# EAGLE design ToastSchematic (EAGLE 8.4.1)

## Sheet 1 of 2
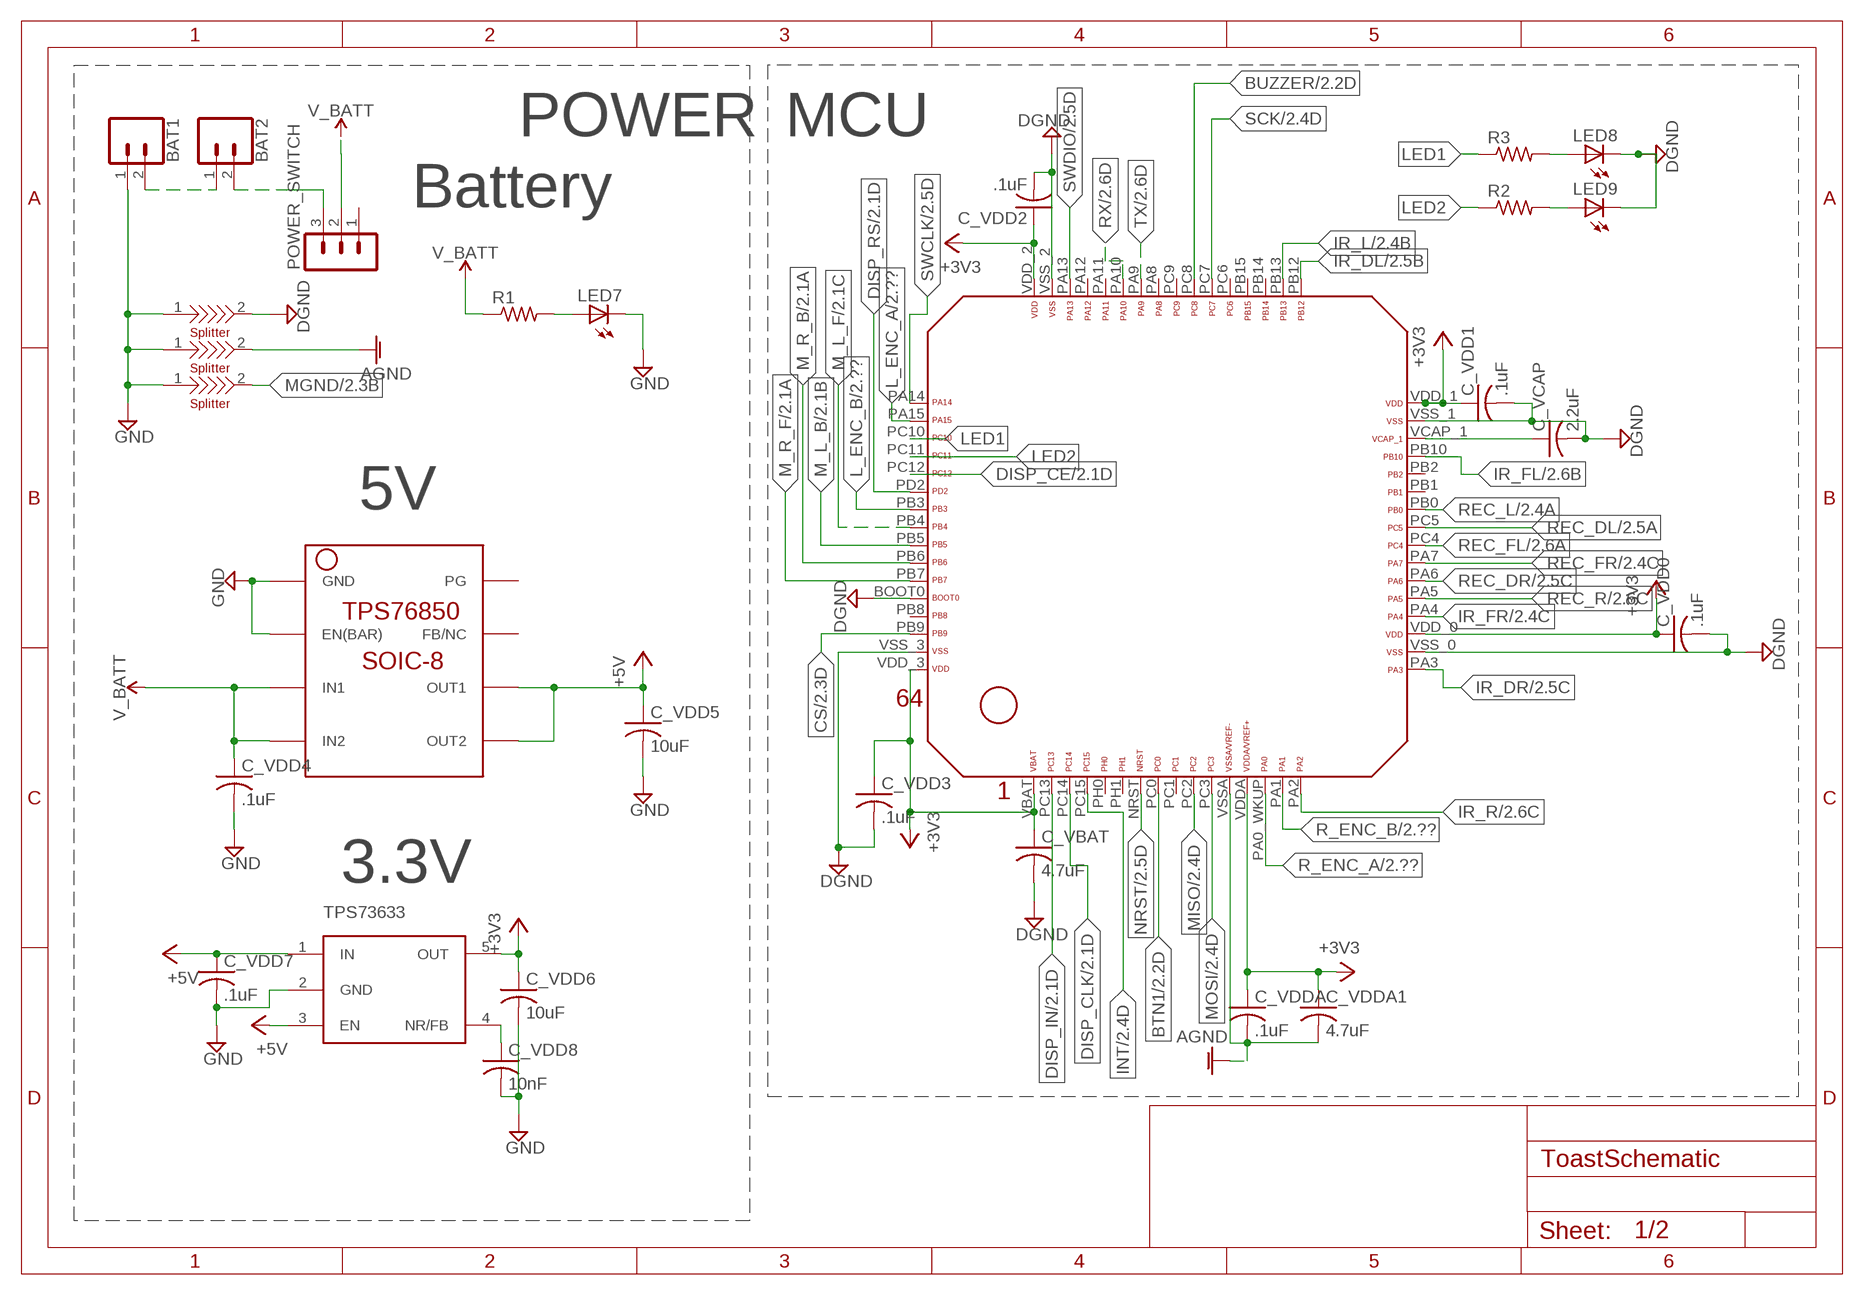
[diagram p0: schematic, sheet 1]

### Parts
BAT1  CONN_02JST-PTH-2  [JST-2-PTH]
BAT2  CONN_02JST-PTH-2  [JST-2-PTH]
C_VBAT  4.7uF  C-USC0603  [C0603]
C_VCAP  2.2uF  C-USC0603  [C0603]
C_VDD0  .1uF  C-USC0603  [C0603]
C_VDD1  .1uF  C-USC0603  [C0603]
C_VDD2  .1uF  C-USC0603  [C0603]
C_VDD3  .1uF  C-USC0603  [C0603]
C_VDD4  .1uF  C-USC0603  [C0603]
C_VDD5  10uF  C-USC0603  [C0603]
C_VDD6  10uF  C-USC0603  [C0603]
C_VDD7  .1uF  C-USC0603  [C0603]
C_VDD8  10nF  C-USC0603  [C0603]
C_VDDA  .1uF  C-USC0603  [C0603]
C_VDDA1  4.7uF  C-USC0603  [C0603]
LED7  LED5MM  [LED5MM]
LED8  LEDCHIPLED_0603  [CHIPLED_0603]
LED9  LEDCHIPLED_0603  [CHIPLED_0603]
POWER_SWITCH  MA03-1  [MA03-1]
R1  R-US_R0603  [R0603]
R2  R-US_R0603  [R0603]
R3  R-US_R0603  [R0603]
U$1  STM32F411/446_LQFP64  [STM32F411/446_LQFP64]
U$2  TPS73633  [SOT23-5L]
U$3  TPS76850(SOIC-8)  [TPS76850(SOIC-8)]
U$5  SPLITTER  [SPLITTER]
U$8  SPLITTER  [SPLITTER]
U$9  SPLITTER  [SPLITTER]

### Nets
+3V3: C_VBAT.1 C_VDD0.1 C_VDD1.1 C_VDD2.1 C_VDD3.1 C_VDD6.1 C_VDDA1.1 C_VDDA.1 U$1.VBAT U$1.VDD_0 U$1.VDD_1 U$1.VDD_2 U$1.VDD_3 U$1.VDDA U$2.5(OUT) ; also sheet 2
+5V: C_VDD5.1 C_VDD7.1 U$2.1(IN) U$2.3(EN) U$3.OUT1 U$3.OUT2 ; also sheet 2
AGND: C_VDDA1.2 C_VDDA.2 U$1.VSSA U$8.2 ; also sheet 2
BTN1: U$1.PC0 ; also sheet 2
BUZZER: U$1.PC8 ; also sheet 2
CS: U$1.PB9 ; also sheet 2
DGND: C_VBAT.2 C_VCAP.2 C_VDD0.2 C_VDD1.2 C_VDD2.2 C_VDD3.2 LED8.C LED9.C U$1.BOOT0 U$1.VSS_0 U$1.VSS_1 U$1.VSS_2 U$1.VSS_3 U$5.2 ; also sheet 2
DISP_CE: U$1.PC12 ; also sheet 2
DISP_CLK: U$1.PC14 ; also sheet 2
DISP_IN: U$1.PC13 ; also sheet 2
DISP_RS: U$1.PD2 ; also sheet 2
GND: BAT1.1 C_VDD4.2 C_VDD5.2 C_VDD6.2 C_VDD7.2 C_VDD8.2 LED7.K(C) U$2.2(GND) U$3.EN(BAR) U$3.GND U$5.1 U$8.1 U$9.1
INT: U$1.PC15 ; also sheet 2
IR_DL: U$1.PB12 ; also sheet 2
IR_DR: U$1.PA3 ; also sheet 2
IR_FL: U$1.PB10 ; also sheet 2
IR_FR: U$1.PA4 ; also sheet 2
IR_L: U$1.PB13 ; also sheet 2
IR_R: U$1.PA2 ; also sheet 2
L_ENC_A: U$1.PA15 ; also sheet 2
L_ENC_B: U$1.PB3 ; also sheet 2
LED1: R3.1 U$1.PC10
LED2: R2.1 U$1.PC11
M_L_B: U$1.PB5 ; also sheet 2
M_L_F: U$1.PB4 ; also sheet 2
M_R_B: U$1.PB6 ; also sheet 2
M_R_F: U$1.PB7 ; also sheet 2
MGND: U$9.2 ; also sheet 2
MISO: U$1.PC2 ; also sheet 2
MOSI: U$1.PC3 ; also sheet 2
N$1: BAT1.2 BAT2.1
N$2: BAT2.2 POWER_SWITCH.3
N$5: C_VCAP.1 U$1.VCAP_1
N$6: C_VDD8.1 U$2.4(NR/FB)
N$21: LED7.A R1.2
N$22: LED8.A R3.2
N$25: LED9.A R2.2
NRST: U$1.NRST ; also sheet 2
R_ENC_A: U$1.PA0_WKUP(PA0_AKUP) ; also sheet 2
R_ENC_B: U$1.PA1 ; also sheet 2
REC_DL: U$1.PC5 ; also sheet 2
REC_DR: U$1.PA6 ; also sheet 2
REC_FL: U$1.PC4 ; also sheet 2
REC_FR: U$1.PA7 ; also sheet 2
REC_L: U$1.PB0 ; also sheet 2
REC_R: U$1.PA5 ; also sheet 2
RX: U$1.PA10 ; also sheet 2
SCK: U$1.PC7 ; also sheet 2
SWCLK: U$1.PA14 ; also sheet 2
SWDIO: U$1.PA13 ; also sheet 2
TX: U$1.PA9 ; also sheet 2
V_BATT: C_VDD4.1 POWER_SWITCH.2 R1.1 U$3.IN1 U$3.IN2 ; also sheet 2
Unconnected: POWER_SWITCH.1 U$1.PA8 U$1.PA11 U$1.PA12 U$1.PB1 U$1.PB2 U$1.PB8 U$1.PB14 U$1.PB15 U$1.PC1 U$1.PC6 U$1.PC9 U$1.PH0 U$1.PH1 U$3.FB/NC U$3.PG

### Notes on the sheet
- POWER | MCU
- Battery
- 5V
- 3.3V

## Sheet 2 of 2
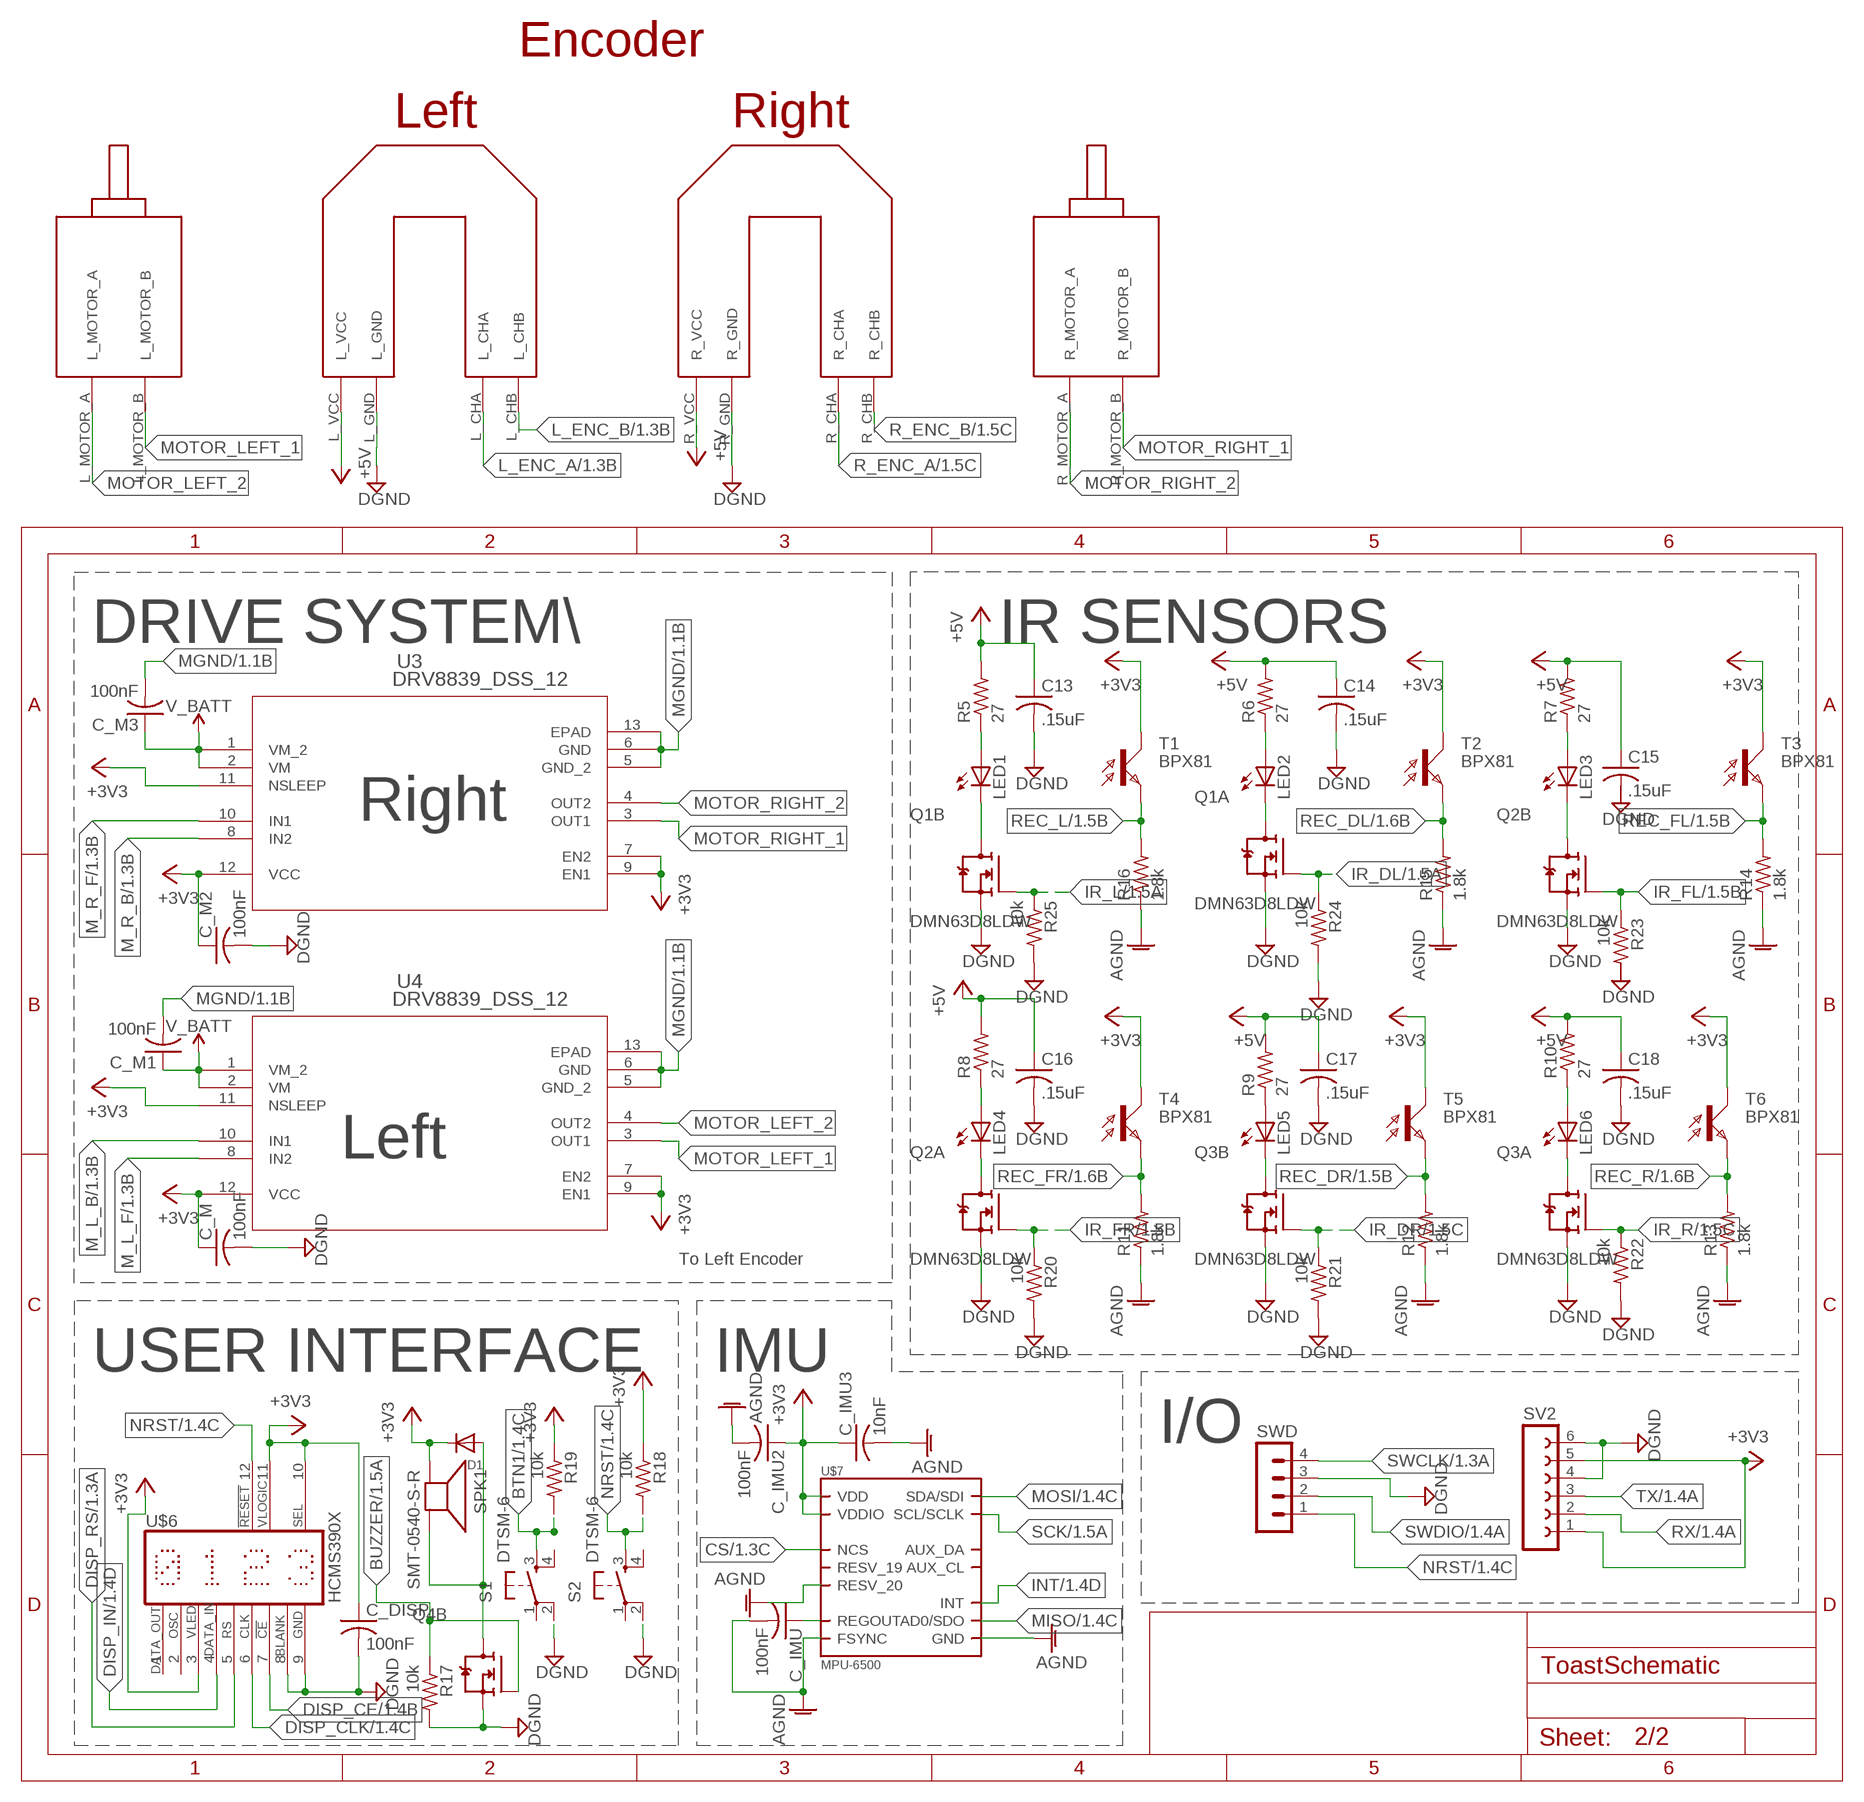
[diagram p1: schematic, sheet 2]

### Parts
C13  .15uF  C-USC0603K  [C0603K]
C14  .15uF  C-USC0603K  [C0603K]
C15  .15uF  C-USC0603K  [C0603K]
C16  .15uF  C-USC0603K  [C0603K]
C17  .15uF  C-USC0603K  [C0603K]
C18  .15uF  C-USC0603K  [C0603K]
C_DISP  100nF  C-USC0603K  [C0603K]
C_IMU  100nF  C-USC0603K  [C0603K]
C_IMU2  100nF  C-USC0603K  [C0603K]
C_IMU3  10nF  C-USC0603K  [C0603K]
C_M  100nF  C-USC0603K  [C0603K]
C_M1  100nF  C-USC0603K  [C0603K]
C_M2  100nF  C-USC0603K  [C0603K]
C_M3  100nF  C-USC0603K  [C0603K]
D1  DIODESOD-323F  [SOD-323F]
LED1  LED5MM  [LED5MM]
LED2  LED5MM  [LED5MM]
LED3  LED5MM  [LED5MM]
LED4  LED5MM  [LED5MM]
LED5  LED5MM  [LED5MM]
LED6  LED5MM  [LED5MM]
Q1  DMN63D8LDW  [SOT363]
Q2  DMN63D8LDW  [SOT363]
Q3  DMN63D8LDW  [SOT363]
Q4  DMN63D8LDW  [SOT363]
R5  27  R-US_R0603  [R0603]
R6  27  R-US_R0603  [R0603]
R7  27  R-US_R0603  [R0603]
R8  27  R-US_R0603  [R0603]
R9  27  R-US_R0603  [R0603]
R10  27  R-US_R0603  [R0603]
R11  1.8k  R-US_R0603  [R0603]
R12  1.8k  R-US_R0603  [R0603]
R13  1.8k  R-US_R0603  [R0603]
R14  1.8k  R-US_R0603  [R0603]
R15  1.8k  R-US_R0603  [R0603]
R16  1.8k  R-US_R0603  [R0603]
R17  10k  R-US_R0603  [R0603]
R18  10k  R-US_R0603  [R0603]
R19  10k  R-US_R0603  [R0603]
R20  10k  R-US_R0603  [R0603]
R21  10k  R-US_R0603  [R0603]
R22  10k  R-US_R0603  [R0603]
R23  10k  R-US_R0603  [R0603]
R24  10k  R-US_R0603  [R0603]
R25  10k  R-US_R0603  [R0603]
S1  DTSM-6  [DTSM-6]
S2  DTSM-6  [DTSM-6]
SPK1  SMT-0540-S-R  [SMT-0540-S-R]
SV2  FE06-1  [FE06]
SWD  MA04-1  [MA04-1]
T1  BPX81  [BPX81]
T2  BPX81  [BPX81]
T3  BPX81  [BPX81]
T4  BPX81  [BPX81]
T5  BPX81  [BPX81]
T6  BPX81  [BPX81]
U3  DRV8839_DSS_12  [DSS12_P9X2]
U4  DRV8839_DSS_12  [DSS12_P9X2]
U$4  FUTURA_V1.0_MOTOR_MOUNT  [FUTURA_V1.0_MOTOT_MOUNT]
U$6  HCMS390X  [HCMS390X]
U$7  MPU-6500  [QFN.24.4X4]

### Nets
+3V3: C_DISP.1 C_IMU2.1 C_IMU3.1 C_M2.1 C_M.1 D1.C R18.1 R19.1 SPK1.-(+) SV2.1 SV2.5 T1.C T2.C T3.C T4.C T5.C T6.C U3.7(EN2) U3.9(EN1) U3.11(NSLEEP) U3.12(VCC) U4.7(EN2) U4.9(EN1) U4.11(NSLEEP) U4.12(VCC) U$6.3(VLED) U$6.10(SEL) U$6.11(VLOGIC) U$7.8(VDDIO) U$7.13(VDD) ; also sheet 1
+5V: C13.1 C14.1 C15.1 C16.1 C17.1 C18.1 R5.2 R6.2 R7.2 R8.2 R9.2 R10.2 U$4.L_VCC U$4.R_VCC ; also sheet 1
AGND: C_IMU2.2 C_IMU3.2 C_IMU.2 R11.1 R12.1 R13.1 R14.1 R15.1 R16.1 U$7.11(FSYNC) U$7.18(GND) U$7.20(RESV_20) ; also sheet 1
BTN1: R19.2 S1.3 ; also sheet 1
BUZZER: Q4.5(B:G) R17.1 ; also sheet 1
CS: U$7.22(NCS) ; also sheet 1
DGND: C13.2 C14.2 C16.2 C17.2 C18.2 C_DISP.2 C_M2.2 C_M.2 Q1.1(A:S) Q1.4(B:S) Q2.1(A:S) Q2.4(B:S) Q3.1(A:S) Q3.4(B:S) Q4.4(B:S) R17.2 R20.2 R21.2 R22.2 R24.2 R25.2 S1.2 S2.2 SV2.4 SV2.6 SWD.3 U$4.L_GND U$4.R_GND U$6.8(BLANK) U$6.9(GND) ; also sheet 1
DISP_CE: U$6.7(!CE) ; also sheet 1
DISP_CLK: U$6.6(CLK) ; also sheet 1
DISP_IN: U$6.4(IN) ; also sheet 1
DISP_RS: U$6.5(RS) ; also sheet 1
INT: U$7.12(INT) ; also sheet 1
IR_DL: Q1.2(A:G) R24.1 ; also sheet 1
IR_DR: Q3.5(B:G) R21.1 ; also sheet 1
IR_FL: Q2.5(B:G) R23.1 ; also sheet 1
IR_FR: Q2.2(A:G) R20.1 ; also sheet 1
IR_L: Q1.5(B:G) R25.1 ; also sheet 1
IR_R: Q3.2(A:G) R22.1 ; also sheet 1
L_ENC_A: U$4.L_CHA ; also sheet 1
L_ENC_B: U$4.L_CHB ; also sheet 1
M_L_B: U4.10(IN1) ; also sheet 1
M_L_F: U4.8(IN2) ; also sheet 1
M_R_B: U3.8(IN2) ; also sheet 1
M_R_F: U3.10(IN1) ; also sheet 1
MGND: C_M1.2 C_M3.2 U3.5(GND_2) U3.6(GND) U3.13(EPAD) U4.5(GND_2) U4.6(GND) U4.13(EPAD) ; also sheet 1
MISO: U$7.9(AD0/SDO) ; also sheet 1
MOSI: U$7.24(SDA/SDI) ; also sheet 1
MOTOR_LEFT_1: U4.3(OUT1) U$4.L_MOTOR_B
MOTOR_LEFT_2: U4.4(OUT2) U$4.L_MOTOR_A
MOTOR_RIGHT_1: U3.3(OUT1) U$4.R_MOTOR_B
MOTOR_RIGHT_2: U3.4(OUT2) U$4.R_MOTOR_A
N$8: LED1.A R5.1
N$9: LED1.K(C) Q1.3(B:D)
N$10: LED2.A R6.1
N$11: LED2.K(C) Q1.6(A:D)
N$12: LED3.K(C) Q2.3(B:D)
N$13: LED3.A R7.1
N$14: LED6.A R10.1
N$15: LED6.K(C) Q3.6(A:D)
N$16: LED4.A R8.1
N$17: C_IMU.1 U$7.10(REGOUT)
N$18: LED4.K(C) Q2.6(A:D)
N$19: LED5.A R9.1
N$20: LED5.K(C) Q3.3(B:D)
N$23: D1.A Q4.3(B:D) SPK1.+(-)
NRST: R18.2 S2.3 SWD.1 U$6.12(NOT_RESET) ; also sheet 1
R_ENC_A: U$4.R_CHA ; also sheet 1
R_ENC_B: U$4.R_CHB ; also sheet 1
REC_DL: R15.2 T2.E ; also sheet 1
REC_DR: R12.2 T5.E ; also sheet 1
REC_FL: R14.2 T3.E ; also sheet 1
REC_FR: R11.2 T4.E ; also sheet 1
REC_L: R16.2 T1.E ; also sheet 1
REC_R: R13.2 T6.E ; also sheet 1
RX: SV2.2 ; also sheet 1
SCK: U$7.23(SCL/SCLK) ; also sheet 1
SWCLK: SWD.4 ; also sheet 1
SWDIO: SWD.2 ; also sheet 1
TX: SV2.3 ; also sheet 1
V_BATT: C_M1.1 C_M3.1 U3.1(VM_2) U3.2(VM) U4.1(VM_2) U4.2(VM) ; also sheet 1
Unconnected: C15.2 Q4.1(A:S) Q4.2(A:G) Q4.6(A:D) R23.2 S1.1 S1.4 S2.1 S2.4 U$6.1(OUT) U$6.2(OSC) U$7.7(AUX_CL) U$7.19(RESV_19) U$7.21(AUX_DA)

### Notes on the sheet
- DRIVE SYSTEM\ | IR SENSORS
- Right
- Left
- To Left Encoder
- USER INTERFACE | IMU
- I/O

## Library data of the parts
BAT1 BAT2 = SparkFun-Connectors:CONN_02: Multi connection point. Often used as Generic Header-pin footprint for 0.1 inch spaced/style header connections On any of the 0.1 inch spaced packages, you can populate with these: Break Away Headers - Straight <https://www.sparkfun.com/products/116> (PRT-00116) Break Away Male Headers - Right Angle <https://www.sparkfun.com/products/553> (PRT-00553) Female Headers <https://www.sparkfun.com/products/115> (PRT-00115) Break Away Headers - Machine Pin <https://www.sparkfun.com/products/117> (PRT-00117) Break Away Female Headers - Swiss Machine Pin <https://www.sparkfun.com/products/743> (PRT-00743) For SCREWTERMINALS and SPRING TERMINALS visit here: Screw Terimnals on SparkFun.com <https://www.sparkfun.com/search/results?term=Screw+Terminals> (5mm/3.5mm/2.54mm spacing) This device is also useful as a general connection point to wire up your design to another part of your project. Our various solder wires solder well into these plated through hole pads. Hook-Up Wire - Assortment (Stranded, 22 AWG) <https://www.sparkfun.com/products/11375> (PRT-11375) Hook-Up Wire - Assortment (Solid Core, 22 AWG) <https://www.sparkfun.com/products/11367> (PRT-11367) View the entire wire category on our website here <https://www.sparkfun.com/categories/141> Special notes: Molex polarized connector foot print use with: PRT-08233 with associated crimp pins and housings. 2.54_SCREWTERM for use with PRT-10571. 3.5mm Screw Terminal footprints for PRT-08084 5mm Screw Terminal footprints for use with PRT-08432; PROD_ID: CONN-09863; SKU: PRT-09914
C13-C18 C_DISP C_IMU C_IMU2 C_IMU3 C_M C_M1-C_M3 C_VBAT C_VCAP C_VDD0 C_VDD1-C_VDD8 C_VDDA C_VDDA1 = rcl:C-US: CAPACITOR, American symbol
D1 = adafruit:DIODE: Diode SMADIODE - SMA Surface Mount Package 20V 1A Schottky Diode Digikey: 641-1014-6-ND DO-1N4148 - Through Hole Small Current Diode SOD-123 20V 1 A (.5mV Vf) Schottky Diode - Digikey: MBRX120TPMSCT-ND SOD-323 10V 570mA (.38mV Vf, 3ns) Schottky Diode - Digikey: ZLLS410CT-ND SOD-523 30V 30mA Schottky Diode (RB751S-40TE61) - Digikey: RB751S-40TE61CT-ND SOT23-R/W - SOT23 Package (R = Solder Paste/Reflow Ovens, W = Hand-Soldering) BAT54Film 40V 300mA - Digikey: 497-7162-1-ND
LED1-LED9 = led:LED: LED OSRAM: - CHIPLED LG R971, LG N971, LY N971, LG Q971, LY Q971, LO R971, LY R971 LH N974, LH R974 LS Q976, LO Q976, LY Q976 LO Q996 - Hyper CHIPLED LW Q18S LB Q993, LB Q99A, LB R99A - SideLED LS A670, LO A670, LY A670, LG A670, LP A670 LB A673, LV A673, LT A673, LW A673 LH A674 LY A675 LS A676, LA A676, LO A676, LY A676, LW A676 LS A679, LY A679, LG A679 - Hyper Micro SIDELED® LS Y876, LA Y876, LO Y876, LY Y876 LT Y87S - SmartLED LW L88C, LW L88S LB L89C, LB L89S, LG L890 LS L89K, LO L89K, LY L89K LS L896, LA L896, LO L896, LY L896 - TOPLED LS T670, LO T670, LY T670, LG T670, LP T670 LSG T670, LSP T670, LSY T670, LOP T670, LYG T670 LG T671, LOG T671, LSG T671 LB T673, LV T673, LT T673, LW T673 LH T674 LS T676, LA T676, LO T676, LY T676, LB T676, LH T676, LSB T676, LW T676 LB T67C, LV T67C, LT T67C, LS T67K, LO T67K, LY T67K, LW E67C LS E67B, LA E67B, LO E67B, LY E67B, LB E67C, LV E67C, LT E67C LW T67C LS T679, LY T679, LG T679 LS T770, LO T770, LY T770, LG T770, LP T770 LB T773, LV T773, LT T773, LW T773 LH T774 LS E675, LA E675, LY E675, LS T675 LS T776, LA T776, LO T776, LY T776, LB T776 LHGB T686 LT T68C, LB T68C - Hyper Mini TOPLED® LB M676 - Mini TOPLED Santana® LG M470 LS M47K, LO M47K, LY M47K Source: http://www.osram.convergy.de LUXEON: - LUMILED® LXK2-PW12-R00, LXK2-PW12-S00, LXK2-PW14-U00, LXK2-PW14-V00 LXK2-PM12-R00, LXK2-PM12-S00, LXK2-PM14-U00 LXK2-PE12-Q00, LXK2-PE12-R00, LXK2-PE12-S00, LXK2-PE14-T00, LXK2-PE14-U00 LXK2-PB12-K00, LXK2-PB12-L00, LXK2-PB12-M00, LXK2-PB14-N00, LXK2-PB14-P00, LXK2-PB14-Q00 LXK2-PR12-L00, LXK2-PR12-M00, LXK2-PR14-Q00, LXK2-PR14-R00 LXK2-PD12-Q00, LXK2-PD12-R00, LXK2-PD12-S00 LXK2-PH12-R00, LXK2-PH12-S00 LXK2-PL12-P00, LXK2-PL12-Q00, LXK2-PL12-R00 Source: www.luxeon.com KINGBRIGHT: KA-3528ASYC Source: www.kingbright.com
POWER_SWITCH = con-lstb:MA03-1: PIN HEADER; OC_FARNELL: unknown; OC_NEWARK: unknown
Q1-Q4 = DMN63D8LDW:DMN63D8LDW: Dual N-channel enhancement mode MOSFET
R1 R5-R25 = rcl:R-US_: RESISTOR, American symbol
R2 R3 = resistor:R-US_: RESISTOR, American symbol
S1 S2 = switch-tact:DTSM-6
SPK1 = SMT-0540-S-R:SMT-0540-S-R: SMT-0549-S-R Small surface-mount magnetic buzzer; AVAILABILITY: Good; DESCRIPTION: Audio Indicator Transducer Electromagnetic 3Vp-p 100mA Solder Pad 2Vp-p 3500Hz to 4500Hz Surface Mount; MF: PUI Audio; MP: SMT-0540-S-R; PACKAGE: None; PRICE: 2.43 USD
SV2 = con-lsta:FE06-1: FEMALE HEADER; OC_FARNELL: unknown; OC_NEWARK: unknown
SWD = con-lstb:MA04-1: PIN HEADER; OC_FARNELL: unknown; OC_NEWARK: unknown
T1-T6 = opto-trans-siemens:BPX81: PHOTO TRANSISTOR; OC_FARNELL: unknown; OC_NEWARK: unknown
U3 U4 = DRV8839:DRV8839_DSS_12; MANUFACTURER_PART_NUMBER: drv8839_dss_12; VENDOR: Texas Instruments
U$1 = STM32F10x F4xx:STM32F411/446_LQFP64
U$2 = TPS73633-and-More:TPS73633
U$3 = TPS76850SOIC-8:TPS76850(SOIC-8)
U$4 = Futura 1.0 motor mount template:FUTURA_V1.0_MOTOR_MOUNT
U$5 U$8 U$9 = splitter:SPLITTER
U$6 = display-hp:HCMS390X
U$7 = invensense:MPU-6500

## Board
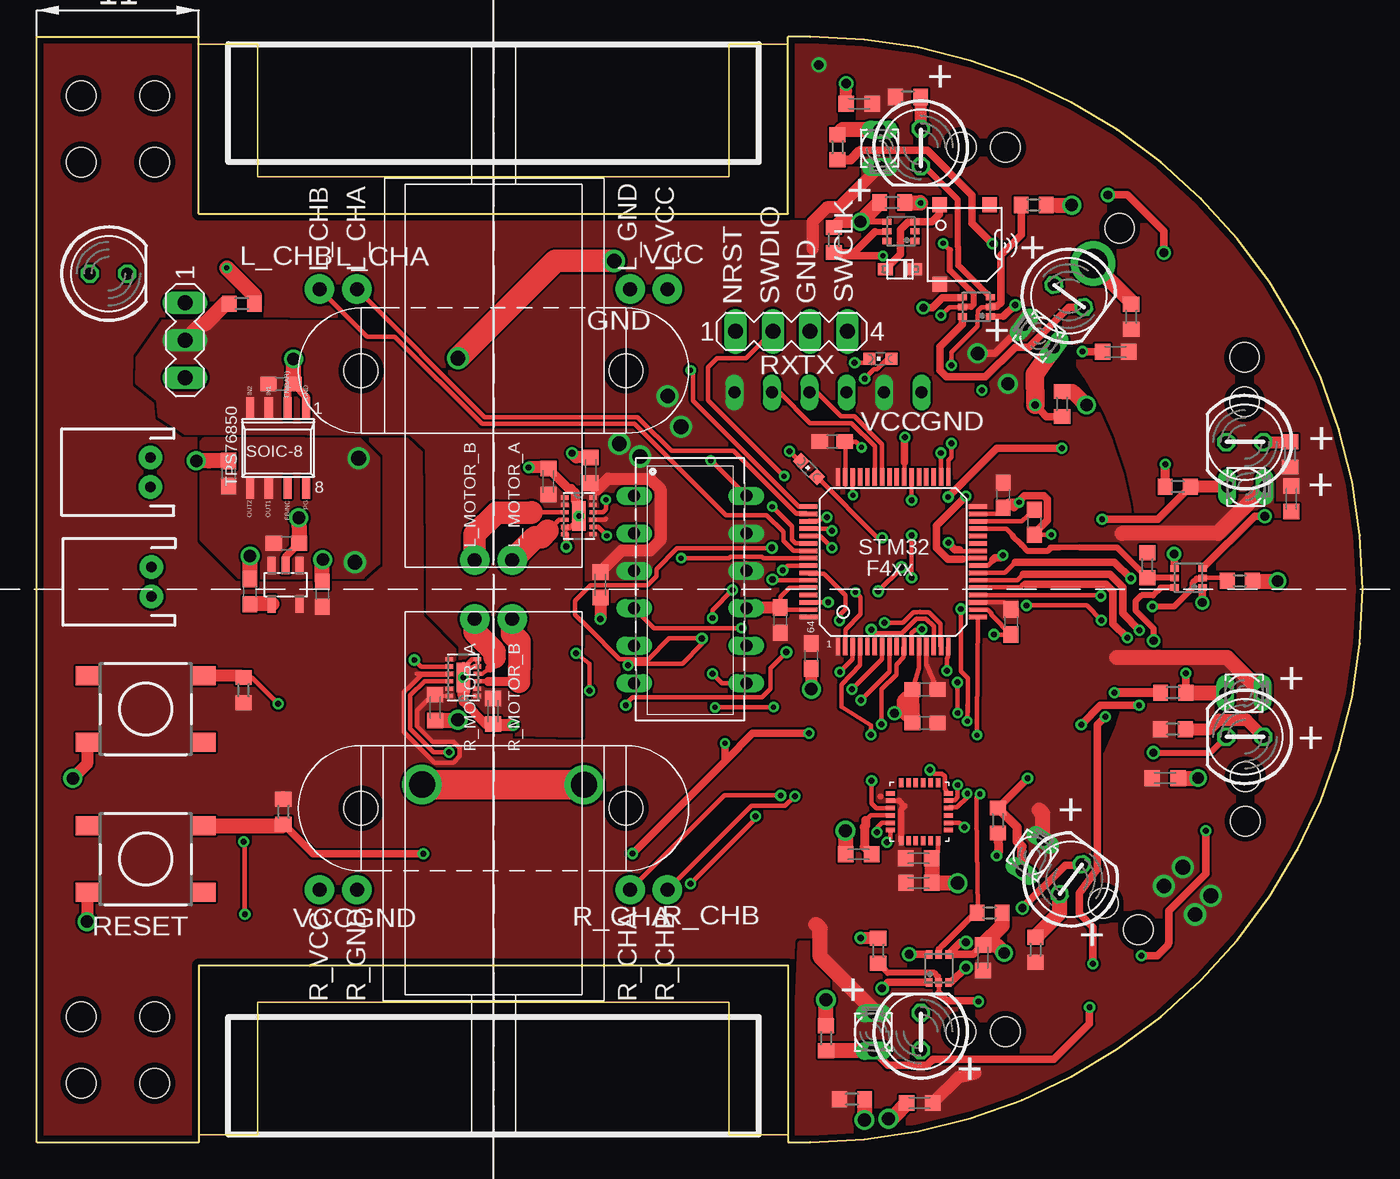
[diagram p2: board, top side]
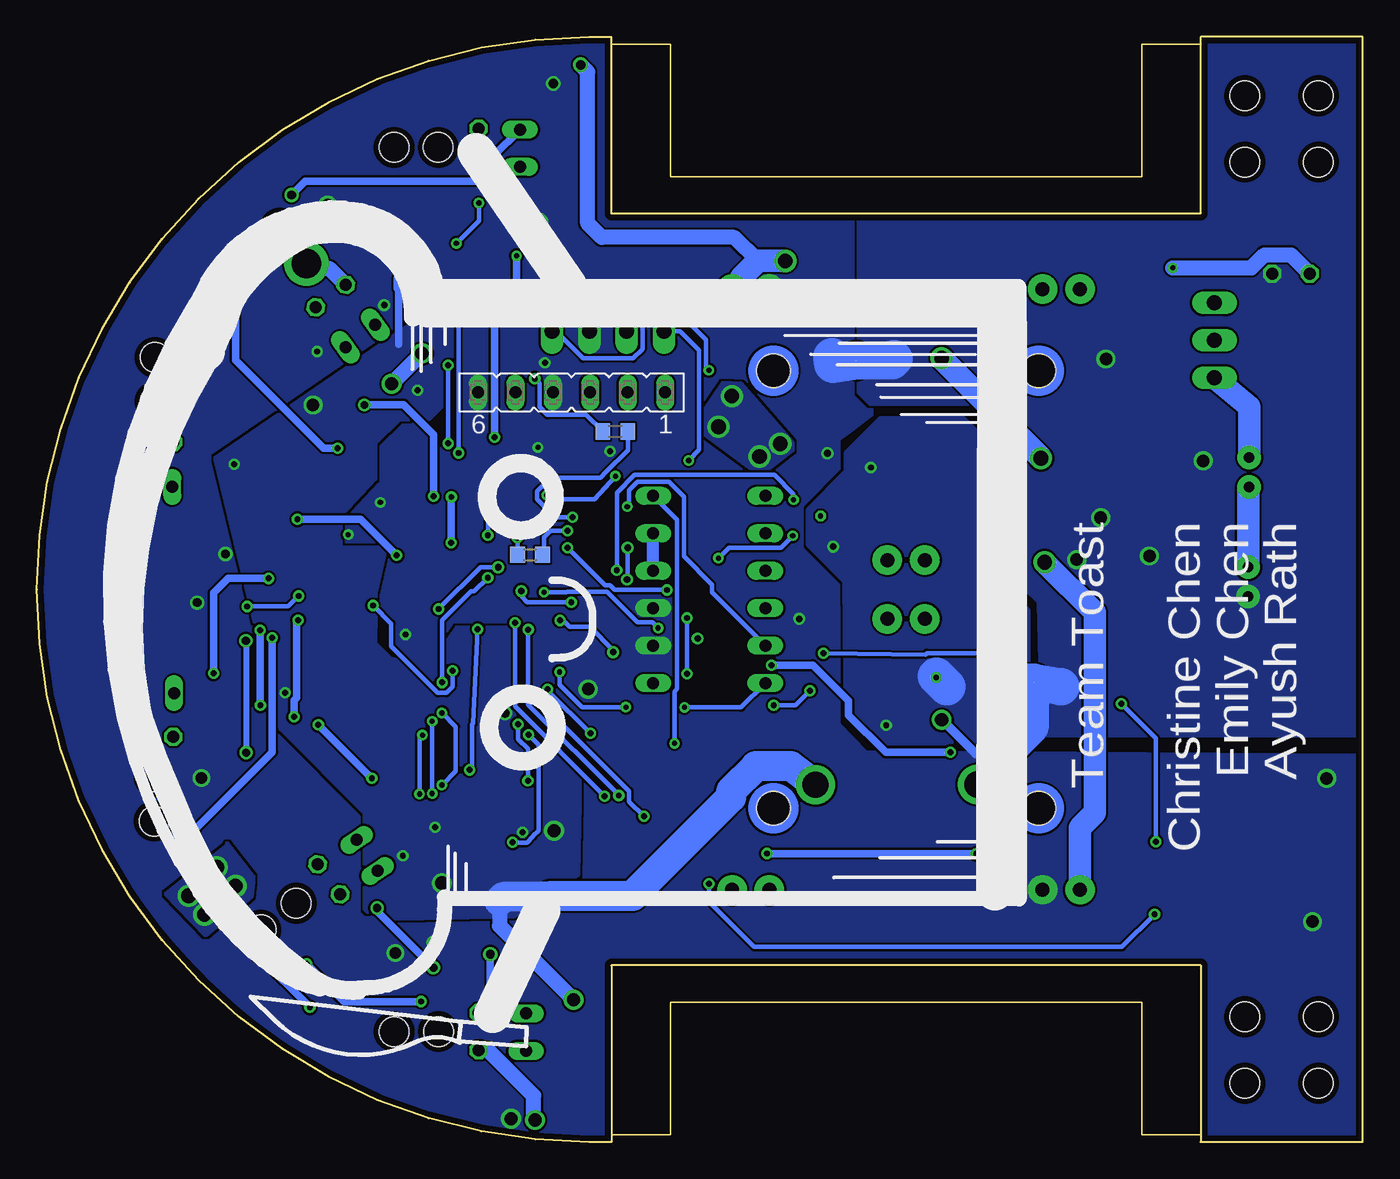
[diagram p3: board, bottom side, seen from below]

Size 90 x 75 mm. Coordinates in mm from the lower left corner, seen from the top.
Outline: 0,0 11,0 11,12 51,12 51,0 52.5,0 arc180 52.5,75 51,75 51,63 11,63 11,75 0,75 0,0
Copper layers (1*16): Top 0.0356mm / dielectric 1.5011mm / Bottom 0.0356mm
Design rules "oshpark-2layer (1)": minimum track width 6mil, minimum drill 13mil, track to track 6mil, track to pad 6mil, pad to pad 6mil, via to via 6mil, smd to smd 6mil, copper to edge 15mil, drill to drill 6mil, minimum pad ring 7mil, minimum via ring 7mil, stop-mask expansion 2.5mil, vias tented up to drill 0mil, thermal gap 10mil
Holes 2 mm at 62.75,67.5 65.75,67.5 81.98,50.25 81.98,53.25 82.04,24.78 82.04,21.78 62.74,7.5 65.74,7.5 73.5,62.01 72.39,16.21 74.79,14.4 3,71 8,71 3,66.5 8,66.5 3,8.5 8,8.5 3,4 8,4

### Footprints (pad centres in the part's own frame; a part is rotated, then mirrored left to right if it is on the bottom)
JST-2-PTH = drill 0.7 pad 1.6: 1 -1,0; 2 1,0
C0603K = smd 1.05 x 1.08: 1 -0.875,0; 2 0.875,0
C0603 = smd 1.1 x 1: 1 -0.85,0; 2 0.85,0
SOD-323F = smd 1 x 0.8: A -1,0; C 1,0
LED5MM = drill 0.813 octagon: A -1.27,0; K 1.27,0
CHIPLED_0603 = smd 0.8 x 0.8: A 0,-0.75; C 0,0.75
MA03-1 = drill 1.016 long: 1 -2.54,0; 2 0,0; 3 2.54,0
SOT363 = smd 0.42 x 0.6: 1 -0.65,-0.95; 2 0,-0.95; 3 0.65,-0.95; 4 0.65,0.95; 5 0,0.95; 6 -0.65,0.95
R0603 = smd 1 x 1.1: 1 -0.85,0; 2 0.85,0
DTSM-6 = smd 1.55 x 1.3: 1 -3.975,2.25; 2 3.975,2.25; 3 -3.975,-2.25; 4 3.975,-2.25
SMT-0540-S-R = smd 1 x 1: + 1.7,-2.7; - 1.7,2.7; M -1.7,-2.7
FE06 = drill 0.813 long: 1 -6.35,0; 2 -3.81,0; 3 -1.27,0; 4 1.27,0; 5 3.81,0; 6 6.35,0
MA04-1 = drill 1.016 long: 1 -3.81,0; 2 -1.27,0; 3 1.27,0; 4 3.81,0
BPX81 = drill 0.813 long: C 1.27,0; E -1.27,0
DSS12_P9X2 = smd 0.5 x 0.28: 1 -0.959,1.25; 2 -0.959,0.75; 3 -0.959,0.25; 4 -0.959,-0.25; 5 -0.959,-0.75; 6 -0.959,-1.25; 7 0.959,-1.25; 8 0.959,-0.75; 9 0.959,-0.25; 10 0.959,0.25; 11 0.959,0.75; 12 0.959,1.25 | smd 0.9 x 2: 13 0,0 | drill 0.35 pad 0.406 octagon: V_1 0,0
STM32F411/446_LQFP64 = smd 1.2 x 0.3: BOOT0 -5.75,-1.75; PA3 5.75,-3.75; PA4 5.75,-2.25; PA5 5.75,-1.75; PA6 5.75,-1.25; PA7 5.75,-0.75; PA14 -5.75,3.75; PA15 -5.75,3.25; PB0 5.75,0.75; PB1 5.75,1.25; PB2 5.75,1.75; PB3 -5.75,0.75; PB4 -5.75,0.25; PB5 -5.75,-0.25; PB6 -5.75,-0.75; PB7 -5.75,-1.25; PB8 -5.75,-2.25; PB9 -5.75,-2.75; PB10 5.75,2.25; PC4 5.75,-0.25; PC5 5.75,0.25; PC10 -5.75,2.75; PC11 -5.75,2.25; PC12 -5.75,1.75; PD2 -5.75,1.25; VCAP_1 5.75,2.75; VDD_0 5.75,-2.75; VDD_1 5.75,3.75; VDD_3 -5.75,-3.75; VSS_0 5.75,-3.25; VSS_1 5.75,3.25; VSS_3 -5.75,-3.25 | smd 0.3 x 1.2: NRST -0.75,-5.75; PA0_WKUP 2.75,-5.75; PA1 3.25,-5.75; PA2 3.75,-5.75; PA8 -0.25,5.75; PA9 -0.75,5.75; PA10 -1.25,5.75; PA11 -1.75,5.75; PA12 -2.25,5.75; PA13 -2.75,5.75; PB12 3.75,5.75; PB13 3.25,5.75; PB14 2.75,5.75; PB15 2.25,5.75; PC0 -0.25,-5.75; PC1 0.25,-5.75; PC2 0.75,-5.75; PC3 1.25,-5.75; PC6 1.75,5.75; PC7 1.25,5.75; PC8 0.75,5.75; PC9 0.25,5.75; PC13 -3.25,-5.75; PC14 -2.75,-5.75; PC15 -2.25,-5.75; PH0 -1.75,-5.75; PH1 -1.25,-5.75; VBAT -3.75,-5.75; VDD_2 -3.75,5.75; VDDA 2.25,-5.75; VSS_2 -3.25,5.75; VSSA 1.75,-5.75
SOT23-5L = smd 0.55 x 1.2: 1 -0.95,-1.3; 2 0,-1.3; 3 0.95,-1.3; 4 0.95,1.3; 5 -0.95,1.3
TPS76850(SOIC-8) = smd 0.55 x 1.5: EN(BAR) -0.635,-2.7; FB/NC -0.635,2.7; GND -1.905,-2.7; IN1 0.635,-2.7; IN2 1.905,-2.7; OUT1 0.635,2.7; OUT2 1.905,2.7; PG -1.905,2.7
FUTURA_V1.0_MOTOT_MOUNT = drill 0.95 pad 2: L_CHA -20.375,26.73; L_CHB -20.375,24.19; L_GND -20.375,45.27; L_MOTOR_A -2,37.27; L_MOTOR_B -2,34.73; L_VCC -20.375,47.81; R_CHA 20.375,45.27; R_CHB 20.375,47.81; R_GND 20.375,26.73; R_MOTOR_A 2,34.73; R_MOTOR_B 2,37.27; R_VCC 20.375,24.19 | hole 2.286: 14.85,45; 14.85,27; -14.85,27; -14.85,45
SPLITTER = smd 0.102 x 0.102: 1 0,0; 2 0,0
HCMS390X = drill 0.813 long: 1 -6.35,-3.81; 2 -3.81,-3.81; 3 -1.27,-3.81; 4 1.27,-3.81; 5 3.81,-3.81; 6 6.35,-3.81; 7 6.35,3.81; 8 3.81,3.81; 9 1.27,3.81; 10 -1.27,3.81; 11 -3.81,3.81; 12 -6.35,3.81
QFN.24.4X4 = smd 0.61 x 0.305: 1 -1.975,1.25; 2 -1.975,0.75; 3 -1.975,0.25; 4 -1.975,-0.25; 5 -1.975,-0.75; 6 -1.975,-1.25; 13 1.975,-1.25; 14 1.975,-0.75; 15 1.975,-0.25; 16 1.975,0.25; 17 1.975,0.75; 18 1.975,1.25 | smd 0.305 x 0.61: 7 -1.25,-1.975; 8 -0.75,-1.975; 9 -0.25,-1.975; 10 0.25,-1.975; 11 0.75,-1.975; 12 1.25,-1.975; 19 1.25,1.975; 20 0.75,1.975; 21 0.25,1.975; 22 -0.25,1.975; 23 -0.75,1.975; 24 -1.25,1.975

### Placement (x,y rotation side)
BAT1  7.78,38.02 90 top
BAT2  7.7,45.46 90 top
C13  55.83,70.47 180 top
C14  73.24,53.62 180 top
C15  85.16,43.66 270 top
C16  76.58,24.7 0 top
C17  64.22,12.51 90 top
C18  59.93,2.66 180 top
C_DISP  38.25,37.82 270 top
C_IMU  55.79,19.54 180 top
C_IMU2  59.87,19.26 0 top
C_IMU3  59.87,17.59 0 top
C_M  37.59,45.59 90 top
C_M1  34.73,44.83 90 top
C_M2  27.03,29.48 270 top
C_M3  30.97,29.24 270 top
C_VBAT  52.56,32.98 270 top
C_VCAP  67.71,42.06 270 top
C_VDD0  66.13,35.29 270 top
C_VDD1  65.59,43.9 270 top
C_VDD2  53.99,47.53 0 top
C_VDD3  50.46,35.42 90 top
C_VDD4  16.58,51.45 0 top
C_VDD5  13.03,45.37 90 top
C_VDD6  19.38,37.18 90 top
C_VDD7  16.95,40.63 0 top
C_VDD8  14.47,37.35 90 top
C_VDDA  60.28,28.44 180 top
C_VDDA1  60.28,30.71 180 top
D1  58.6,59.23 0 top
LED1  60,67.5 270 top
LED2  70.05,57.42 323 top
LED3  82,47.5 180 top
LED4  82,27.5 180 top
LED5  70.18,17.83 53 top
LED6  60,7.5 90 top
LED7  4.88,58.93 0 top
LED8  57.27,53.15 90 top
LED9  52.42,45.67 45 top
POWER_SWITCH  10.06,54.41 270 top
Q1  63.77,56.67 90 top
Q2  78.18,38.28 90 top
Q3  61.22,11.78 0 top
Q4  58.66,61.8 90 top
R1  13.92,56.89 0 top
R2  56.52,39.85 180 bottom
R3  50.73,48.22 180 bottom
R5  59.14,70.92 180 top
R6  74.28,56.01 270 top
R7  85.06,46.67 270 top
R8  77.11,28.02 180 top
R9  67.78,13.06 270 top
R10  55.34,2.92 180 top
R11  77.14,30.5 0 top
R12  65.24,21.82 90 top
R13  53.57,7.04 270 top
R14  77.44,44.48 0 top
R15  69.6,50.08 270 top
R16  54.35,67.51 90 top
R17  54.1,61.21 90 top
R18  16.74,22.41 270 top
R19  14.04,30.67 90 top
R20  81.66,38.08 0 top
R21  64.68,15.56 0 top
R22  57.12,12.98 90 top
R23  75.38,39.15 90 top
R24  67.67,63.59 0 top
R25  58.06,63.75 180 top
S1  7.39,29.39 180 top
S2  7.39,19.21 180 top
SPK1  62.98,60.91 180 top
SV2  53.7,50.87 180 bottom
SWD  51.23,55.01 0 top
T1  57.21,67.44 270 top
T2  68.04,54.69 143 top
T3  82.07,44.46 0 top
T4  81.95,30.46 0 top
T5  67.58,19.46 56 top
T6  56.79,7.46 90 top
U3  28.95,31.52 180 top
U4  36.8,42.49 0 top
U$1  58.13,39.37 0 top
U$2  16.9,37.82 180 top
U$3  16.39,47.1 180 top
U$4  -5,37.5 270 top
U$5  34.39,53.04 90 bottom
U$6  44.35,37.5 270 top
U$7  59.92,22.42 270 top
U$8  55.19,16.64 90 bottom
U$9  22.33,31.19 90 bottom

### Tracks (layer width: path | path; a pad name or v marks a point on that pad's centre or on a via)
+3V3  (via drill 0.9, 1)
  Top 0.305: U$1.VDD_0 65.65,36.62 C_VDD0.1 | U$1.VDDA 60.38,32.42 C_VDDA1.1 | U4.9 38.58,42.24 38.63,42.29 | 25.78,31.77 U3.9 27.99,31.73 27.14,31.72 26.32,31.72 26.13,31.72 25.16,30.78 25.03,30.65 24.89,30.52 24.89,30.51 24.89,30.32 24.89,30.14 24.89,27.85 26.98,25.76 28.28,25.76 28.7,26.17 28.7,26.76 28.28,27.18 26.86,27.18 25.81,28.23 25.81,29.32 26.77,30.26 U3.12 | 58.54,23.17 U$7.8
  Top 0.406: 58.54,23.17 58.9,22.8 58.66,22.57 U$7.13 | 57.27,23.44 57.26,23.45
  Top 0.508: T2.C 66.14,54.56 66.11,54.56 66.06,54.56 65.02,53.52 v63.86,53.52
  Top 0.813: 48.16,39.02 U$6.10 | T1.C 54.46,63.42 53.62,63.42 52.66,62.46 52.66,60.6 | C_M.1 38.03,44.28 38.78,45.02 41.64,45.02 42.32,44.33 42.32,40.83 41.64,40.14 39.7,40.14 C_DISP.1
  Top 1.016: 16.69,23.32 R18.1 | 52.88,14.78 53.16,14.5 53.16,12.56 56.79,8.94 T6.C | T5.C 68.29,22.29 68.05,22.53 | T4.C 80.81,32.87 73.3,32.87 | T3.C 80.18,41.3 73.66,41.3
  Bottom 0.813: U$6.10 U$6.11
  Bottom 1.016: v63.86,53.52 v65.91,51.46
  other vias: 39.54,47.38 42.82,50.62 40.95,46.52 43.73,48.54
  pour Top (rank 5, no thermals): 0.25,74.62 10.62,74.62 10.62,62.75 10.75,62.62 20.38,62.62 51.12,62.62 51.38,62.88 51.38,74.62 52.75,74.62 arc-90 89.88,37.5 arc-92 51.25,0 51.25,12.38 10.88,12.38 10.75,12.38 10.75,0.12 0.12,0.12 0.12,74.62
  pour Bottom: 38.7,47.45 38.72,46.94 40.42,45.61 41.37,45.6 45.43,48.56 43.42,51.54 42.22,51.46 38.73,47.48
+5V  (via drill 0.65, 1)
  Top 0.813: C18.1 62.56,4.41 63.72,4.69
  Top 1.524: v28.59,53.2 35.2,59.79 v39.19,59.79
  Bottom 1.016: 41.06,59.79 42.67,61.4 51.66,61.4 52.6,62.34 52.6,72.61 v53.09,73.1
  Bottom 1.524: U$4.R_VCC 19.19,21.33 18.19,22.33 18.19,35.94 v21.59,39.34 | U$4.L_VCC 42.18,58.5 42.18,58.67 41.06,59.79 v39.19,59.79 | v21.84,46.41 21.84,46.43 v28.59,53.2
  other vias: 76.52,17.38 77.79,18.65 79.68,16.72 78.62,15.45
  pour Top (no thermals): 51.25,63 51.25,74.62 52.38,74.62 arc-90 89.5,37.5 arc-92 51.38,0.5 51.93,13.41 arc90 75.12,36.62 75.12,39.12 arc90
  pour Top (rank 4, no thermals): 11.12,47.5 11.12,40.88 13.75,38.25 22.15,38.33 23.25,39.27 23.25,46.42 23.06,46.61 21.87,47.8 11.38,47.75
  pour Bottom: 77.09,20.27 75.28,17.99 75.42,16.68 78.54,14.05 81.27,16.84 77.04,20.16
AGND  (via drill 0.4, 0.6, 0.85, 0.9)
  Top 0.305: v57.02,21.03 57.02,21.34 57.35,21.67 U$7.11 | U$7.20 62.64,21.67 v62.97,21.36 | U$7.18 61.17,19.69 C_IMU2.2 | U$1.VSSA 59.88,32.17 C_VDDA1.2
  Top 0.508: 64.18,51.05 v64.16,51.03 | v64.87,60.96 63.48,62.35 63.48,64.26 60.44,67.3 55.89,67.3
  Top 0.61: R14.1 76.59,45.99 v76.61,46 | R11.1 73.17,30.5 v73.15,30.48 | R12.1 65.27,19.62 v65.15,19.43 | R16.1 55.25,66.66 55.89,67.3 | 58.66,29.21 C_VDDA.2 | 58.66,29.21 v58.2,29.09 | C_VDDA1.2 58.66,29.93 58.66,29.21
  Top 1.016: C_IMU2.2 60.77,18.43 C_IMU3.2 62.49,17.59 v62.51,17.58 | C_VDDA1.2 59.41,29.63 C_VDDA.2 59.41,29.55 | R13.1 | R13.1 v53.57,9.65 | C_IMU.2 54.91,20.73 v54.89,21.13 | R15.1 70.33,50.93 v71.25,50.01
  Bottom 0.508: v64.87,60.96 64.87,59.26 65.53,58.6 65.53,57.93 65.43,57.83 65.43,54.15
  Bottom 1.016: v53.57,9.65 58.6,14.68 58.6,16.36
  Bottom 2.032: U$8.2 58.32,16.64 58.6,16.36
  pour Bottom (rank 3, no thermals): 56.88,34.23 56.88,29.11 56.39,28.5 56.12,28.12 53.14,24.98 53.11,22.98 53.24,18.1 57.62,15.25 63.75,15.12 66.62,15.12 67.25,15.25 67.75,15.75 67.75,22.25 73.5,28 77.92,46.46 62.88,56.75 60.75,54.62 60.75,51.62 63.38,49 65.38,49 67,47.38 67,44.96 69.36,42.45 69.36,40.39 66.27,40.39 66.96,37.29 66.98,35.92 67,33.88 66,32.88 64.22,32.5 62.99,32.88 61.52,34.98 57.76,34.98
BTN1  (via drill 0.4)
  Top 0.305: U$1.PC0 57.88,31.92 v55.93,29.97 | v48.79,22.1 48.79,21.95 v44.37,17.53 | v14.12,15.47 14.12,20.32 v14.05,20.39 | v16.38,29.74 14.61,31.52 R19.2
  Top 0.813: S1.3 13.92,31.64 R19.2
  Bottom 0.305: v48.79,22.1 49.79,23.1 49.79,23.81 v55.93,29.96 v55.93,29.97 | v44.37,17.53 44.37,16.3 41.31,13.24 16.35,13.24 v14.12,15.47 | v14.05,20.39 14.05,27.41 v16.38,29.74
BUZZER  (via drill 0.35, 0.4)
  Top 0.305: 58.9,46.13 58.88,45.95 U$1.PC8
  Top 0.406: 56.88,61.77 57.67,61.77 57.68,61.77
  Top 0.508: v58.93,47.83 58.9,47.8 58.9,46.13 | 57.68,61.77 Q4.5 | v57.43,60.14 54.33,60.14 R17.1 55.48,60.36 56.88,61.77
  Bottom 0.508: 58.95,56.64 58.93,56.62 | v58.93,47.83 58.93,56.62 | 58.93,56.62 57.43,58.11 v57.43,60.14
CS  (via drill 0.35, 0.4, 0.45)
  Top 0.305: v53.72,36.63 53.52,36.62 U$1.PB9 | U$7.22 61.94,22.71 62.47,22.71 63.2,23.43 63.2,23.62 v63.16,23.65 | v62.73,36.17 62.73,31.95 63.2,31.48 63.19,29.69 | 63.19,29.69 63.19,28.56 | v63.16,28.56 63.16,29.67 63.19,29.69 | v57.11,37.39 58.68,38.96 v58.68,39.01
  Bottom 0.305: v53.72,36.63 56.71,36.63 57.11,37.03 v57.11,37.39 | v62.73,36.17 59.89,39.01 v58.68,39.01 | v63.16,23.65 v63.16,28.56
DGND  (via drill 0.35, 0.4, 0.45, 0.55, 0.6, 0.65, 0.8, 0.85, 0.9)
  Top 0.305: 54.88,44.59 U$1.VSS_2 54.88,47.49 C_VDD2.2 55.59,47.53 v55.98,47.14 | 60.05,51.4 SV2.6 | U$1.VSS_0 64.56,36.12 64.79,35.9 64.79,35.78 C_VDD0.2 v64.97,34.44 | U$1.VSS_3 arc-90 U$1.VSS_3 50.61,36.12 C_VDD3.2 50.47,36.28 50.47,37.01 51.09,37.62 U$1.BOOT0 | U$1.VSS_1 65.17,42.62 C_VDD1.2 66.31,43.05 66.65,43.38 v66.68,43.41 | C_VCAP.2 68.84,41.21 v68.86,41.22 | LED8.C 56.26,52.9 v55.51,52.9 | LED9.C 51.78,46.2 v51.1,46.89 | Q4.4
  Top 0.406: Q4.4 55.98,62.46 | Q1.1 65.62,56.02
  Top 0.508: C14.2 70.99,53.62 v70.97,53.65 | 55.98,62.46 v55.91,62.46 | 65.62,56.02 66.4,56.79 v66.42,56.79 | Q1.4 62.78,57.29 61.47,57.29 60.79,56.62 v60.17,56.62 | C17.2 63.57,12.73 Q3.4 62.69,13.55 v63.07,13.55 | Q3.1 57.78,10.83 v57.38,10.43 | Q2.4 77.2,38.96 v77.2,39.9 | Q2.1 79.11,37.61 v79.11,36.61 | 66.31,43.05 66.8,43.5 66.8,43.63 67.04,43.87 68.38,43.87 68.61,43.63 68.61,42.19 68.38,41.95 67.71,41.33 C_VCAP.2 | v66.68,43.41 65.95,43.41 C_VDD1.2
  Top 0.813: C_VDD3.2 48.21,36.27 U$6.9 | C_VBAT.2 52.56,31.86 v52.58,30.73 | S1.2 3.42,25.67 v2.44,24.69 | S2.2 3.42,14.97 v3.4,14.96 | C13.2 54.93,71.31 v54.94,71.83 | R17.2 54.5,62.46 v55.91,62.46 | C_M.2 36.61,46.47 v36.33,46.74 | C_DISP.2 v38.25,35.51 | R22.2 55.94,13.83 v55.92,13.86
  Top 1.016: U$6.9 48.05,36.12 | R25.2 v55.91,62.46 | R24.2 69.3,63.56 v70.26,63.58 | R20.2 v84.23,38.08 | R21.2 65.53,14.69 C17.2 65.1,13.38 v65.66,12.83 | C_M2.2 28.44,28.61 v28.58,28.65 | C18.2 58.1,1.7 v57.81,1.59 | C16.2 v78.82,24.7
  Bottom 0.305: 26.27,26.34 26.16,26.25
  Bottom 0.61: v28.58,28.65 26.27,26.34
  Bottom 2.54: U$5.2 35.97,52.78 36.04,53.29
  pour Bottom (rank 6, no thermals): 0.4,26.32 0.38,0.25 10.75,0.25 10.75,12.25 51.25,12.25 51.25,0.12 51.62,0.12 arc90 89.75,38.25 arc93 51.25,74.88 51.25,62.75 33.38,62.75 33.32,49.28 34.77,48.16 35.51,47.62 35.51,47.01 35.51,28.42 33.71,26.54
DISP_CE  (via drill 0.4)
  Top 0.305: U$1.PC12 53.18,41.12 v53.97,40.34 | v47.22,37.47 45.85,36.1 v45.85,35.56 | v45.85,31.79 46.5,31.15 U$6.7
  Bottom 0.305: v53.97,40.34 51.43,37.79 51.1,37.79 50.78,37.47 v47.22,37.47 | v45.85,35.56 v45.85,31.79
DISP_CLK  (via drill 0.35)
  Top 0.305: v46.03,29.5 v50.01,29.51 | v54.51,31.9 55.38,32.78 U$1.PC14
  Bottom 0.305: U$6.6 42.19,29.5 v46.03,29.5 | v50.01,29.51 51.08,29.52 52.98,29.52 54.51,31.04 v54.51,31.9
DISP_IN  (via drill 0.35)
  Top 0.305: U$6.4 41.89,34.88 v47.83,34.88 | v55.57,37.31 55.91,36.97 55.91,35.81 54.88,34.78 U$1.PC13
  Bottom 0.305: v47.83,34.88 48.21,35.27 49.22,35.27 51.29,37.34 54.01,37.34 54.04,37.31 v55.57,37.31
DISP_RS  (via drill 0.35)
  Top 0.305: v49.92,43.12 51.26,41.78 51.26,40.88 51.51,40.62 U$1.PD2
  Bottom 0.305: U$6.5 44.17,37.32 44.17,37.83 46.08,39.74 46.08,43.79 47.1,44.81 49.22,44.81 49.79,44.25 49.79,43.25 v49.92,43.12
GND  (via drill 0.85, 1.78)
  Top 0.508: U$2.2 16.9,39.73 C_VDD7.2 | U$3.EN(BAR) 17.02,51.04 C_VDD4.2 18.29,50.59 U$3.GND
  Top 1.016: C_VDD8.2 14.47,39.51 v14.48,39.78 | C_VDD6.2 19.38,39.49 v19.41,39.52 | C_VDD7.2 17.8,41.83 v17.78,42.37 | C_VDD5.2 11.68,46.22 v10.82,46.23 | C_VDD4.2 17.43,52.9 v17.42,53.14
  Top 2.032: v26.14,24.27 v37.15,24.24
  Bottom 2.032: U$8.1 55.12,16.71 49.55,16.71 42.87,23.39 42.87,23.84 41.19,25.52 38.81,25.52 v37.15,24.24 | U$9.1 22.33,28.12 v26.14,24.27
  Bottom 2.54: 20.47,30.89 U$9.1 | U$5.1 31.95,53.03 31.83,53.16
  pour Bottom (no thermals): 0.25,74.75 0.25,27.5 21.84,27.5 21.88,29.91 22.05,36.6 24.13,38.61 24.56,39.01 24.61,48.08 26.54,50.01 33.45,50.01 34.25,50.81 34.25,62.75 10.75,62.75 10.75,74.75
INT  (via drill 0.4)
  Top 0.305: U$7.12 57.95,20.6 v57.7,20.35 | v56.62,27.65 56.62,28.28 54.62,29.53 54.62,31.03 55.88,32.35 U$1.PC15
  Bottom 0.305: v57.7,20.35 57.34,20.35 57.32,20.32 56.73,20.32 56.31,20.74 56.31,20.77 55.96,21.13 55.96,26.98 v56.62,27.65
IR_DL  (via drill 0.4)
  Top 0.305: Q1.2 64.14,56.67 63.88,56.41 63.88,56.15 63.86,56.12 63.86,55.37 62.07,53.59 v62.07,52.7 | U$1.PB12 61.88,46.27 62.07,46.47 v62.07,47.41
  Top 0.508: Q1.2 64.75,56.71 65.19,56.71 65.43,56.95 65.43,60.17 66.82,61.56 R24.1
  Bottom 0.305: v62.07,47.41 v62.07,52.7
IR_DR  (via drill 0.35)
  Top 0.305: 63.88,15.74 63.88,15.61 | 63.88,15.74 63.79,22.29 | 63.79,22.29 | U$1.PA3 63.82,28.44 63.82,28.28 | 63.79,22.29 63.79,23.35 63.82,23.38 63.82,23.42 v64.02,23.62 | 63.82,28.28 v63.82,27.62 | 63.82,28.28 63.82,28.29 | 63.82,28.28 | R21.1 63.83,15.69 63.88,15.74
  Top 0.406: 63.88,15.74 61.53,13.39 61.51,13.39 61.22,13.09 Q3.5
  Bottom 0.305: v64.02,23.62 64.02,27.41 v63.82,27.62
IR_FL
  Top 0.305: U$1.PB10 65.81,41.62 66.23,41.2 66.23,41.16
  Top 0.406: Q2.5 77.21,38.3 R23.1 73.32,40.35 70.78,40.35 69.42,40.34 68.82,40.34 68.59,40.11 67.25,40.11 66.85,40.51 66.85,40.54 66.23,41.16
IR_FR  (via drill 0.4)
  Top 0.305: Q2.2 80.61,38.28 R20.1 | v72.24,37.06 72.17,37.12 U$1.PA4
  Top 0.406: v75.72,36.35 77.2,36.35 78.47,37.62 78.47,37.99 78.73,38.24 79.09,38.24 Q2.2
  Bottom 0.305: v75.72,36.35 72.95,36.35 v72.24,37.06
IR_L  (via drill 0.35, 0.4)
  Top 0.305: v61.38,56.1 61.95,56.67 Q1.5 | U$1.PB13 61.38,46.75 v61.37,46.76 | 61.98,60.52 v61.52,60.98 | v59.99,63.73 59.97,63.75
  Top 0.406: Q1.5 63.42,56.67 63.6,56.85 63.6,57.56 63.27,57.89 63.24,57.89 61.98,59.16 61.98,60.51 61.98,60.52
  Top 1.016: R25.1 59.97,63.75 v59.99,63.73
  Bottom 0.305: v61.37,46.76 61.37,56.08 v61.38,56.1 | v61.52,60.98 59.99,62.51 v59.99,63.73
IR_R  (via drill 0.4)
  Top 0.305: U$1.PA2 61.84,33.58 61.84,32.9 61.78,32.84 v61.78,31.98 | v67.18,36.42 71.26,36.42 v72.26,35.42 | Q3.2 61.22,10.09
  Top 0.406: Q3.2 61.18,10.87 61.18,11.23 60.93,11.49 57.76,11.49 R22.1
  Top 0.508: 61.22,10.09 61.74,9.58 63.88,9.58 v63.92,9.54 | v71.69,12.1 71.69,14.59 70.75,15.53 70.75,16.89 72.01,18.55 72.01,28.33 v72.53,28.86
  Bottom 0.305: v61.78,31.98 61.78,30.9 62.19,30.48 62.78,30.48 65.95,33.65 65.95,35.18 v67.18,36.42 | v72.26,35.42 72.28,35.42 72.49,35.45
  Bottom 0.508: v63.92,9.54 69.13,9.54 v71.69,12.1 | v72.53,28.86 72.53,29.99 72.37,30.16 72.37,35.34 72.28,35.42
L_ENC_A
  Top 0.305: 52.27,42.62 U$1.PA15 | 52.27,42.62 51.56,42.62 | U$4.L_CHA 30.41,49.2 40.78,49.2 41.05,48.93 43.07,46.91 45.47,46.91 47.29,46.91 51.53,42.67 52.22,42.67 52.27,42.62
L_ENC_B
  Top 0.305: U$4.L_CHB 22.4,54.66 24.3,54.66 30.22,48.74 40.59,48.74 46.79,42.55 49.53,42.55 50.67,41.4 50.67,40.82 51.37,40.12 U$1.PB3
LED1  (via drill 0.4)
  Top 0.305: U$1.PC10 52.42,42.17 53.1,42.17 53.33,42.4 v53.63,42.4
  Bottom 0.305: R3.1 49.88,46.96 51.38,45.46 51.73,45.08 55.14,45.08 56.05,44.16 56.05,43.62 54.85,42.42 53.65,42.42 v53.63,42.4
LED2  (via drill 0.4)
  Top 0.305: U$1.PC11 53.84,41.62 v53.98,41.49
  Bottom 0.305: R2.1 55.55,39.73 55.56,41.06 | 55.56,41.06 55.56,41.08 | v53.98,41.49 55.13,41.49 55.56,41.06
M_L_B  (via drill 0.35, 0.4)
  Top 0.305: U$1.PB5 50.96,39.12 v50.63,38.8 | U4.10 37.76,42.75 38.43,42.75 38.63,42.95 v38.63,43.59
  Bottom 0.305: v50.63,38.8 50.6,38.83 50.6,44.08 49.41,45.27 39.94,45.27 38.63,43.97 v38.63,43.59
M_L_F  (via drill 0.35)
  Top 0.305: U$1.PB4 49.33,39.62 49.22,39.73 47.1,39.73 47,39.63 44.22,39.63 44.21,39.62 v43.74,39.62 | v38.69,41.15 38.1,41.74 U4.8
  Bottom 0.305: v38.69,41.15 38.92,40.92 38.92,40.91 39.48,40.34 43.02,40.34 v43.74,39.62
M_R_B  (via drill 0.4, 0.45)
  Top 0.305: U$1.PB6 52.42,38.58 53.41,38.58 54.89,37.11 54.89,36.14 54.49,35.75 v54.49,35.4 | v25.63,32.71 26.07,32.27 U3.8 | v37.52,30.63 37.52,32.47 v36.61,33.18 | v39.98,29.64 39.98,29.73 40.43,30.18 49.22,30.18 49.79,30.75 49.79,32.16 v50.88,33.25
  Bottom 0.305: v54.49,35.4 54.27,35.4 53.83,34.96 52.46,34.96 50.88,33.38 v50.88,33.25 | v36.61,33.18 29.68,33.07 29.58,33.17 26.09,33.17 v25.63,32.71 | v37.52,30.63 38.51,29.64 v39.98,29.64
M_R_F  (via drill 0.4, 0.45)
  Top 0.305: v27.99,26.47 26.92,26.47 25.35,28.04 25.35,30.32 26.32,31.26 27.14,31.26 U3.10 | v40.13,32.37 40.24,32.47 43.82,32.47 45.15,33.8 v45.15,34.17 42.93,34.17 41.53,32.78 39.55,32.78 37.41,34.92 36.54,35.79 36.54,36.73 37.59,37.78 41.45,37.78 42.07,38.39 42.07,38.88 43.47,40.28 49.85,40.28 v49.9,40.33 | U$1.PB7 50.93,38.12 50.92,38.12 50,38.12 v49.94,38.17
  Bottom 0.305: v49.9,40.33 49.9,38.22 v49.94,38.17
  Bottom 0.508: v40.13,32.37 37.32,32.37 34.9,29.95 34.9,28.98 32.37,26.44 32.34,26.47 v27.99,26.47
MGND  (via drill 0.4, 0.45)
  Top 0.305: U4.5 36.04,41.73 | U4.6 U4.5 | U4.5 | U3.6 U3.5 29.87,32.23 29.55,32.23 29.5,32.18 28.95,32.18 29.55,32.77 U3.6
  Top 0.406: 35.84,41.53 36.04,41.73 36.22,41.73 36.27,41.78 36.8,41.78 U4.13 | U4.6 35.94,41.24 v35.94,40.41
  Top 0.61: C_M1.2 36.09,44.34 36.28,44.34 36.55,44.07 36.55,43.55 36.8,43.3 U4.13 | 28.95,30.39 28.95,29.88 30.54,28.29 31.05,28.29
  Top 0.813: 28.95,30.39 U3.13 28.95,32.18 | C_M1.2 34.65,45.78 v33.39,45.78 | C_M3.2 31.05,28.29 v32.34,28.29
  Bottom 2.54: 28.93,31.6 28.22,30.89 | U$9.2 24.49,31.19
  pour Bottom: 26.29,27.05 33.3,27.05 35.08,28.83 35.18,38.05 37.67,40.54 37.67,42.93 35.08,45.52 35.08,46.79 32.74,49.12 27.1,49.12 25.6,47.62 25.45,38.86 22.68,36.09 22.68,30.68 25.6,27.76 25.6,27.74
MISO  (via drill 0.4)
  Top 0.305: U$1.PC2 58.84,33.58 58.84,32.9 58.34,32.4 58.34,31.73 57.33,30.73 v57.33,28.36 | U$7.9 56.99,22.67 56.66,22.99 v56.67,24.53
  Bottom 0.305: v56.67,24.53 56.66,26.69 57.33,27.35 v57.33,28.35 v57.33,28.36
MOSI  (via drill 0.4)
  Top 0.305: U$7.24 61.63,23.94 61.63,24.82 61.45,25 60.88,25 v60.63,25.25 | v60.07,34.8 59.65,34.78 59.38,34.52 U$1.PC3
  Bottom 0.305: v60.07,34.8 60.38,28.41 60.44,28.35 60.44,25.44 v60.63,25.25
MOTOR_LEFT_1
  Top 0.305: 33.55,42.72 33.57,42.74 U4.3
  Top 1.524: U$4.L_MOTOR_B 29.73,41.26 31.19,42.72 33.55,42.72 33.58,42.74
MOTOR_LEFT_2
  Top 0.305: 34.67,41.47 35.44,42.24 U4.4
  Top 1.524: 34.67,41.47 34.25,41.05 33.82,41.05 U$4.L_MOTOR_A
MOTOR_RIGHT_1
  Top 0.305: U3.3 30.63,31.27 30.64,31.27 | 32.71,31.27 32.74,31.24
  Top 0.61: 30.64,31.27 32.71,31.27
  Top 1.524: U$4.R_MOTOR_B 32.27,34.47 32.75,33.98 32.75,32.2 32.74,32.19 32.74,31.24
MOTOR_RIGHT_2
  Top 0.305: U3.4 30.23,31.77 30.76,32.17
  Top 0.61: 30.76,32.17 30.89,32.35 31.08,32.89
  Top 1.524: 31.08,32.89 31.08,33.29 29.73,34.64 U$4.R_MOTOR_A
N$1
  Bottom 1.524: BAT1.2 7.78,44.38 BAT2.1
N$2
  Bottom 1.524: BAT2.2 7.7,49.89 POWER_SWITCH.3
N$5
  Top 0.305: U$1.VCAP_1 66.86,42.12 C_VCAP.1
N$6
  Top 1.016: U$2.4 14.48,36.52 C_VDD8.1
N$8
  Top 0.813: LED1.A R5.1
N$9
  Top 0.406: Q1.3 62.54,59.5 62.54,60.75 62.51,60.78 62.51,63.96 60.24,66.23 LED1.K
N$10  (via drill 2)
  Top 1.016: R6.1 | LED2.A | R6.1 74.28,57.03 v71.7,59.62
  Bottom 1.016: LED2.A 70.13,59.28 71.36,59.28 v71.7,59.62
N$11
  Top 0.508: Q1.6 62.82,55.5 61.29,53.98 61.29,52.38 61.75,51.92 64.4,51.92 66.43,53.95 67.36,53.95 70.07,56.66 LED2.K
N$12  (via drill 0.6)
  Top 0.508: Q2.3 82.66,42.46 v83.36,42.46
  Bottom 0.508: v83.36,42.46 82.99,42.83 82.92,42.83 82.32,43.43 82.32,45.91 LED3.K
N$13
  Top 0.813: LED3.A 85.05,47.5 R7.1
N$14  (via drill 0.9)
  Top 1.016: R10.1 v56.19,1.51 v56.18,1.5
  Bottom 1.016: v56.18,1.5 56.27,1.59 56.27,3.15 59.35,6.23 LED6.A
N$15  (via drill 0.6)
  Top 0.508: Q3.6 59.24,12.73 v59.22,12.76
  Bottom 0.508: v59.22,12.76 59.22,9.55 LED6.K
N$16
  Top 0.813: R8.1 79.6,28.02 80.25,28.67 82.1,28.67 LED4.A
N$17
  Top 0.305: U$7.10 56.61,22.17 56.26,21.82
  Top 0.61: 56.26,21.82 56.26,21.49 56.16,21.39 56.16,20.03 C_IMU.1
N$18  (via drill 0.55)
  Top 0.406: Q2.6 77.01,37.63 77,37.63 76.28,37.63 75.76,37.11 74.98,37.11 74.58,36.71 74.58,36.08 75.81,34.86 v75.81,34.02 | v75.79,26.43 79.66,26.43 LED4.K
  Bottom 0.406: v75.81,34.02 75.81,26.45 v75.79,26.43
N$19
  Top 1.016: LED5.A 69.41,15.54 R9.1
N$20  (via drill 0.55)
  Top 0.508: Q3.3 62.07,10.83 v63.08,11.84 | v66.9,15.89 69.82,18.8 70.9,18.8
  Top 0.813: 70.9,18.8 LED5.K
  Bottom 0.508: v63.08,11.84 66.9,15.67 v66.9,15.89
N$21  (via drill 0.35)
  Top 1.016: R1.2 14.77,57.44 v12.89,59.32
  Bottom 1.016: v12.89,59.32 7.55,59.32 6.67,60.2 4.88,60.2 LED7.A
N$22  (via drill 0.4)
  Top 0.305: v56.2,51.8 56.84,52.45 57.04,52.45 57.75,53.15 LED8.A
  Bottom 0.305: R3.2 52.71,49.35 55.35,49.35 55.89,49.89 55.89,51.49 v56.2,51.8
N$23
  Top 0.508: D1.A 58.33,59.96 58.62,60.25 58.62,61.89 59.14,62.41 59.58,62.41 Q4.3 60.76,62.45 61.28,62.97 SPK1.+
N$25  (via drill 0.4)
  Top 0.305: LED9.A 57.07,41.02 v57.38,41.02
  Bottom 0.305: v57.38,41.02 57.37,41 R2.2
NRST  (via drill 0.35, 0.4)
  Top 0.305: 46.71,25.81 v46.72,27.06 | U$1.NRST 57.38,32.77 v55.32,30.72 | v45.74,46.25 v45.76,46.25 U$6.12
  Top 0.508: 46.81,25.96 48.59,27.74 v52.43,27.74 | 46.81,25.96 v40.44,19.58 | v46.72,27.06 46.72,26.06 46.81,25.96 | v26.24,19.56 18.75,19.56 R18.2
  Top 1.016: S2.3 16.64,21.46 R18.2
  Bottom 0.305: v46.72,27.06 46.72,30.57 46.54,30.75 46.54,42.22 U$6.12 | v55.32,30.72 55.32,30.64 v52.43,27.74 | SWD.1 46.33,55.01 45.03,53.72 45.03,46.97 v45.74,46.25
  Bottom 0.508: v26.24,19.56 26.26,19.58 v40.44,19.58
R_ENC_A  (via drill 0.4)
  Top 0.305: v50.49,23.52 46.66,23.52 U$4.R_CHA | v56.64,34.78 56.89,34.53 58.73,34.53 59.71,35.51 59.78,35.51 60.36,35.51 60.88,35 U$1.PA0_WKUP
  Bottom 0.305: v56.64,34.78 56.64,29.67 v50.49,23.52
R_ENC_B  (via drill 0.4)
  Top 0.305: v51.45,23.48 50.79,22.81 48.5,22.81 U$4.R_CHB | U$1.PA1 61.34,33.67 61.34,35.19 60.55,35.97 59.95,35.97 59.94,35.98 59.76,35.97 59.53,35.97 59.51,35.97 58.78,35.24 v57.54,35.24
  Bottom 0.305: v57.54,35.24 57.54,29.57 v51.45,23.48
REC_DL  (via drill 0.4, 0.5)
  Top 0.305: 62.84,39.55 62.92,39.62 U$1.PC5
  Top 0.508: v63.06,43.83 61.06,41.83 61.06,40.34 61.85,39.55 62.84,39.55 | v67.77,50.03 68.52,49.23 R15.2
  Top 1.27: T2.E 67.76,52.11 v67.77,50.03
  Bottom 0.508: v63.06,43.83 63.06,48 65.1,50.04 v67.77,50.03
REC_DR  (via drill 0.4)
  Top 0.305: U$1.PA6 65.25,38.12 65.27,38.14 66.58,38.14 66.97,38.53
  Top 0.508: v74.85,34.74 73.71,35.88 73.71,37.67 72.84,38.53 66.97,38.53 | R12.2 v67.26,24.68 v67.26,24.69 | v70.89,28.32 72.21,29.64 v74.83,29.64
  Top 0.61: T5.E 66.87,20.07 66.55,20.4 66.55,21.36 R12.2
  Bottom 0.508: v74.83,29.64 74.85,29.66 v74.85,34.74 | v67.26,24.69 v70.89,28.32
REC_FL  (via drill 0.4)
  Top 0.305: 64.89,39.52 64.79,39.42 64.79,39.35 64.56,39.12 U$1.PC4
  Top 0.508: R14.2 76.08,42.27 v72.31,42.27 | v65.57,39.81 65.42,39.66 65.03,39.66 64.89,39.52
  Top 0.813: R14.2 80.78,44.48 T3.E
  Bottom 0.508: v65.57,39.81 68.02,42.27 v72.31,42.27
REC_FR  (via drill 0.4)
  Top 0.305: 65.88,38.8 66.44,39.36 65.7,38.62 U$1.PA7
  Top 0.508: R11.2 78,30.52 v78,31.8 | 66.44,39.36 73.16,39.36 v74.27,38.25
  Top 1.016: T4.E 78.03,30.46 R11.2
  Bottom 0.508: v78,31.8 78,37.26 77.02,38.25 v74.27,38.25
REC_L  (via drill 0.4, 0.6)
  Top 0.305: U$1.PB0 63.86,40.11 62.64,40.11 62.64,40.21
  Top 0.508: v69.57,47.09 65.17,47.09 61.87,43.78 v61.87,43.77 | v61.87,40.67 62.33,40.21 62.64,40.21 | v76.51,60.35 76.51,61.81 74.02,64.3 72.74,64.3 v72.71,64.27
  Top 1.016: T1.E 54.7,68.71 R16.2
  Bottom 0.508: v69.57,47.09 70.54,47.09 76.51,53.07 v76.51,60.35 | v61.87,43.77 61.87,43.77 v61.87,40.67 | 67.53,65.21 59.59,65.21 58.98,65.81 58.98,66.94 T1.E | 67.53,65.21 | 67.53,65.21 71.77,65.21 v72.71,64.27
REC_R  (via drill 0.4)
  Top 0.305: 67.09,37.87 66.95,37.87 66.75,37.67 63.92,37.67 U$1.PA5
  Top 0.508: v79.36,21.13 79.36,18.21 76.84,15.7 76.84,13.62 arc-45 76.69,13.26 76.07,12.64 v74.98,12.64 | v74.02,34.21 73.05,35.18 73.05,37.39 72.57,37.87 67.09,37.87 | 60.74,5.53 60.42,5.21 57.77,5.21 T6.E | 60.74,5.53 60.83,5.62 | 60.74,5.53 arc-45 60.96,5.62 69.05,5.62 71.46,8.04 v71.46,9.14
  Top 1.016: R13.2 T6.E
  Bottom 0.508: v79.36,21.13 74.02,26.47 v74.02,34.21 | v71.46,9.14 74.96,12.64 v74.98,12.64
RX
  Top 0.305: U$1.PA10 56.88,47.21 55.3,48.79 52.49,48.79 50.41,50.87 SV2.2
SCK  (via drill 0.35, 0.4)
  Top 0.305: U$7.23 61.94,23.21 62.33,23.21 62.51,23.39 v62.51,24.23 | v62.5,29.12 v62.49,31.19 | v59.38,38.3 v59.38,41.17 | v59.38,43.56 U$1.PC7
  Bottom 0.305: v59.38,38.3 60.3,37.39 60.51,37.39 62.49,35.41 v62.49,31.19 | v59.38,41.17 v59.38,43.56 | v62.5,29.12 61.57,28.19 61.57,25.17 v62.51,24.23
SWCLK  (via drill 0.35)
  Top 0.305: 55.02,55.02 SWD.4 | U$1.PA14 51.72,43.12 44.55,50.29 44.55,52.2 v44.38,52.38
  Bottom 0.305: v44.38,52.38 44.58,52.58 44.58,54.45 46.97,56.84 47.86,56.84 48.89,55.81 48.89,53.81 49.51,53.18 52.94,53.18 54.77,55.01 SWD.4
SWDIO  (via drill 0.35)
  Top 0.305: SWD.2 48.13,53.18 46.97,53.18 46.97,53.19 46.18,53.19 45.57,52.58 45.57,50.34 v50.72,45.19 | 55.38,44.55 v55.4,43.89 | 55.38,44.55 55.37,44.91 | U$1.PA13 55.38,44.55
  Bottom 0.305: v50.72,45.19 52.15,43.64 54.97,43.64 v55.4,43.89
TX
  Top 0.305: SV2.3 52.95,50.87 54.57,49.25 55.5,49.25 57.38,47.37 U$1.PA9
V_BATT
  Top 1.016: POWER_SWITCH.2 11.18,55.53 11.41,55.53 12.78,56.89 R1.1
  pour Top (no thermals): 6.83,53.22 6.82,51.54 8.25,50.38 8.35,49.24 10.12,48.11 11.26,48.14 25.39,48.06 26.5,47.06 26.54,40.31 26.54,35.92 28.78,33.68 28.7,30.18 30.43,27.76 32.28,27.66 36.96,27.56 36.9,47.95 36.89,53.37 34.89,55.46 25.5,55.62 8.57,55.7

### Text on the board
tPlace: + | + | L_CHB | L_CHA | VCC | + | NRST | SWDIO | GND | SWCLK | GND | + | RX | TX | VCC | GND | + | + | + | + | + | RESET | VCC | GND | R_CHA | R_CHB | + | + | +
bPlace: Team Toast / / Christine Chen / Emily Chen / Ayush Rath